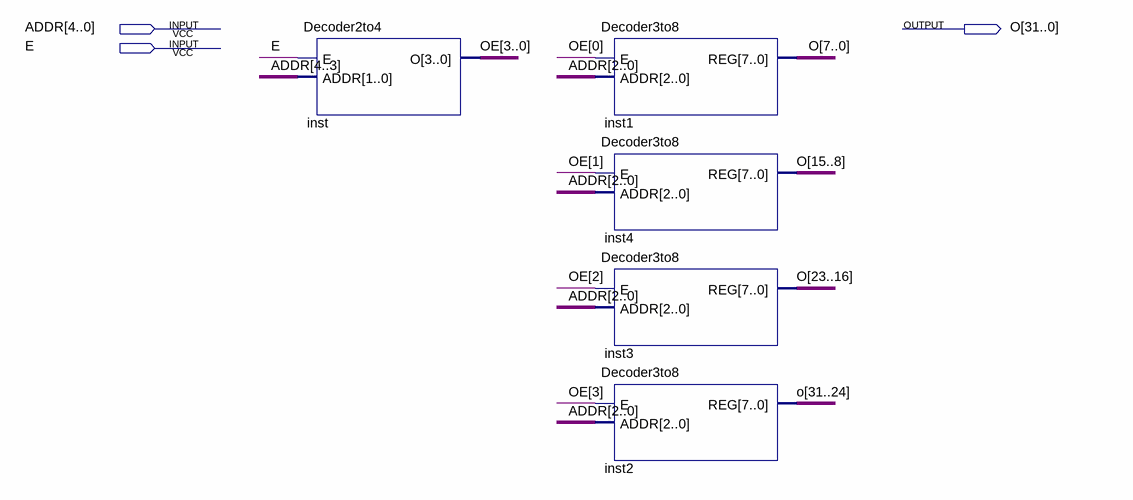
[diagram p0: schematic sheet]
// Quartus schematic Decoder5to32.bdf as structural Verilog: 5 symbols, 3 pins
module Decoder5to32 (
  input  [4:0] ADDR,
  input  E,
  output [31:0] O
);

  wire [3:0] OE;

  Decoder2to4 inst (.E(E), .ADDR(ADDR[4:3]), .O(OE));
  Decoder3to8 inst1 (.E(OE[0]), .ADDR(ADDR[2:0]), .REG(O[7:0]));
  Decoder3to8 inst4 (.E(OE[1]), .ADDR(ADDR[2:0]), .REG(O[15:8]));
  Decoder3to8 inst3 (.E(OE[2]), .ADDR(ADDR[2:0]), .REG(O[23:16]));
  Decoder3to8 inst2 (.E(OE[3]), .ADDR(ADDR[2:0]), .REG(O[31:24]));
endmodule
